# Altium schematic sheet sdhc_memory_card.SchDoc
size A
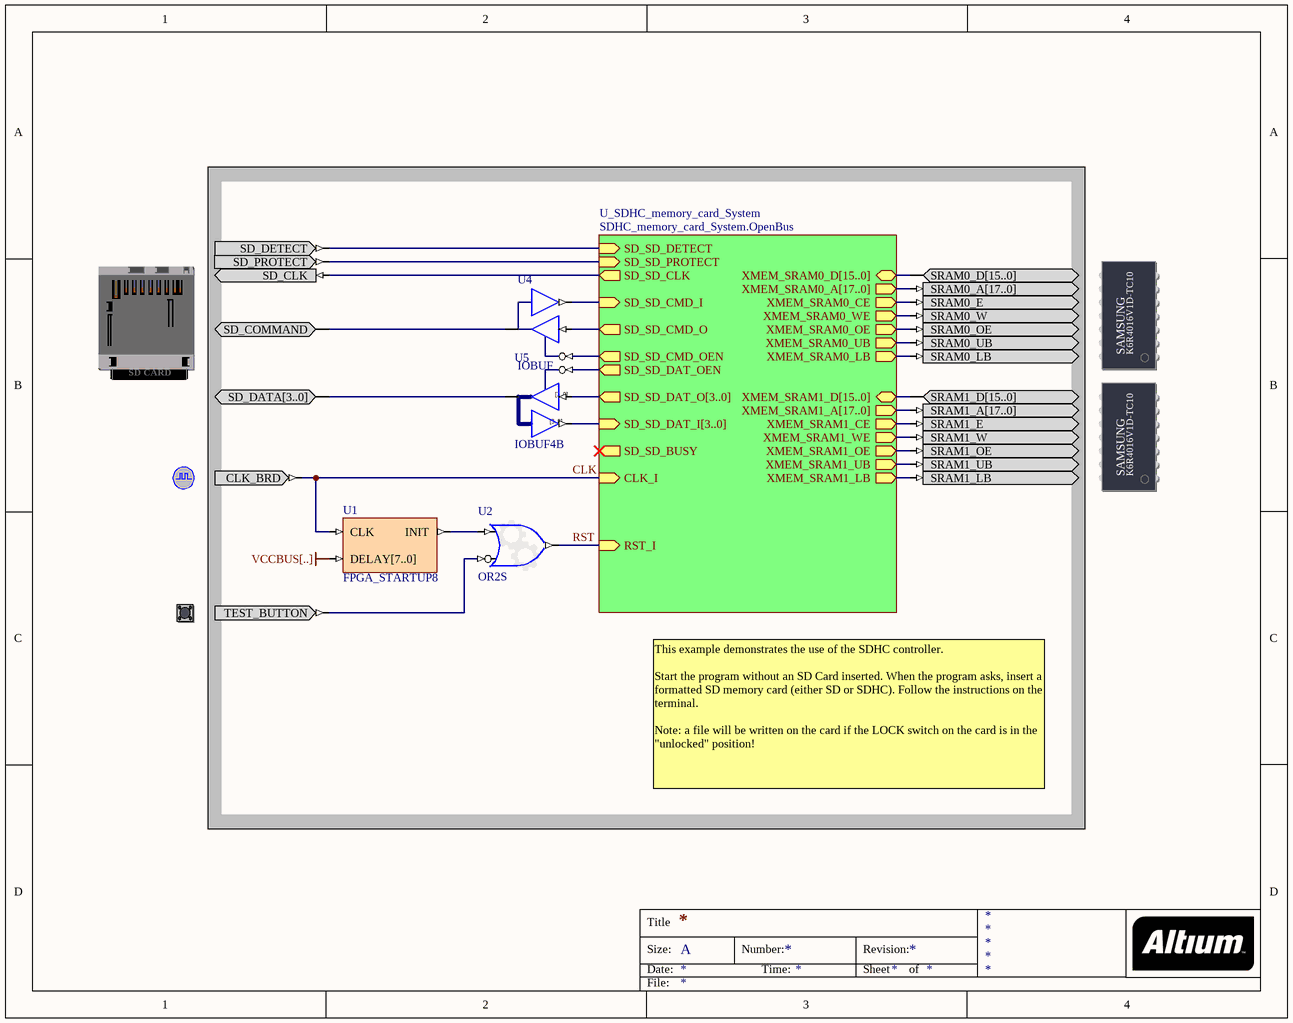
[diagram p0: sdhc_memory_card.SchDoc]

## Parts
(Parts that share a designator on the sheet are numbered #1, #2 ... from top to bottom, then left to right.)
?#1  SDHC  (value not drawn)
?#2  SRAM_DAUGHTER0  (value not drawn)
?#3  SRAM_DAUGHTER1  (value not drawn)
?#4  CLOCK_BOARD  (value not drawn)
?#5  TEST_BUTTON  (value not drawn)
U1  FPGA_STARTUP8
U2  OR2S
U4  IOBUF
U5  IOBUF4B

## Sub-sheets
U_SDHC_memory_card_System = SDHC_memory_card_System.OpenBus: XMEM_SRAM0_D[15..0] (bidir), XMEM_SRAM0_A[17..0] (out), XMEM_SRAM0_CE (out), XMEM_SRAM0_WE (out), XMEM_SRAM0_OE (out), XMEM_SRAM0_UB (out), XMEM_SRAM0_LB (out), XMEM_SRAM1_D[15..0] (bidir), XMEM_SRAM1_A[17..0] (out), XMEM_SRAM1_CE (out), XMEM_SRAM1_WE (out), XMEM_SRAM1_OE (out), XMEM_SRAM1_UB (out), XMEM_SRAM1_LB (out), SD_SD_DETECT (in), SD_SD_PROTECT (in), SD_SD_CLK (out), RST_I (in), CLK_I (in), SD_SD_BUSY (out), SD_SD_CMD_OEN (out), SD_SD_CMD_O (out), SD_SD_CMD_I (in), SD_SD_DAT_OEN (out), SD_SD_DAT_O[3..0] (out), SD_SD_DAT_I[3..0] (in)

## Nets
VCCBUS[..]: U1.DELAY[7..0]
CLK: ?#4.CLK_BRD U1.CLK ; sheet U_SDHC_memory_card_System/CLK_I
RST: U2.O ; sheet U_SDHC_memory_card_System/RST_I
Net?#1_SD_CLK: ?#1.SD_CLK ; sheet U_SDHC_memory_card_System/SD_SD_CLK
Net?#1_SD_COMMAND: ?#1.SD_COMMAND U4.IO
Net?#1_SD_DATA[3..0]: ?#1.SD_DATA[3..0] U5.IO[3..0]
Net?#1_SD_DETECT: ?#1.SD_DETECT ; sheet U_SDHC_memory_card_System/SD_SD_DETECT
Net?#1_SD_PROTECT: ?#1.SD_PROTECT ; sheet U_SDHC_memory_card_System/SD_SD_PROTECT
Net?#2_SRAM0_A[17..0]: ?#2.SRAM0_A[17..0] ; sheet U_SDHC_memory_card_System/XMEM_SRAM0_A[17..0]
Net?#2_SRAM0_D[15..0]: ?#2.SRAM0_D[15..0] ; sheet U_SDHC_memory_card_System/XMEM_SRAM0_D[15..0]
Net?#2_SRAM0_E: ?#2.SRAM0_E ; sheet U_SDHC_memory_card_System/XMEM_SRAM0_CE
Net?#2_SRAM0_LB: ?#2.SRAM0_LB ; sheet U_SDHC_memory_card_System/XMEM_SRAM0_LB
Net?#2_SRAM0_OE: ?#2.SRAM0_OE ; sheet U_SDHC_memory_card_System/XMEM_SRAM0_OE
Net?#2_SRAM0_UB: ?#2.SRAM0_UB ; sheet U_SDHC_memory_card_System/XMEM_SRAM0_UB
Net?#2_SRAM0_W: ?#2.SRAM0_W ; sheet U_SDHC_memory_card_System/XMEM_SRAM0_WE
Net?#3_SRAM1_A[17..0]: ?#3.SRAM1_A[17..0] ; sheet U_SDHC_memory_card_System/XMEM_SRAM1_A[17..0]
Net?#3_SRAM1_D[15..0]: ?#3.SRAM1_D[15..0] ; sheet U_SDHC_memory_card_System/XMEM_SRAM1_D[15..0]
Net?#3_SRAM1_E: ?#3.SRAM1_E ; sheet U_SDHC_memory_card_System/XMEM_SRAM1_CE
Net?#3_SRAM1_LB: ?#3.SRAM1_LB ; sheet U_SDHC_memory_card_System/XMEM_SRAM1_LB
Net?#3_SRAM1_OE: ?#3.SRAM1_OE ; sheet U_SDHC_memory_card_System/XMEM_SRAM1_OE
Net?#3_SRAM1_UB: ?#3.SRAM1_UB ; sheet U_SDHC_memory_card_System/XMEM_SRAM1_UB
Net?#3_SRAM1_W: ?#3.SRAM1_W ; sheet U_SDHC_memory_card_System/XMEM_SRAM1_WE
Net?#5_TEST_BUTTON: ?#5.TEST_BUTTON U2.I1
NetU1_INIT: U1.INIT U2.I0
NetU4_I: U4.I ; sheet U_SDHC_memory_card_System/SD_SD_CMD_O
NetU4_O: U4.O ; sheet U_SDHC_memory_card_System/SD_SD_CMD_I
NetU4_T: U4.T ; sheet U_SDHC_memory_card_System/SD_SD_CMD_OEN
NetU5_I[3..0]: U5.I[3..0] ; sheet U_SDHC_memory_card_System/SD_SD_DAT_O[3..0]
NetU5_O[3..0]: U5.O[3..0] ; sheet U_SDHC_memory_card_System/SD_SD_DAT_I[3..0]
NetU5_T: U5.T ; sheet U_SDHC_memory_card_System/SD_SD_DAT_OEN

## Notes on the sheet
- This example demonstrates the use of the SDHC controller.
  Start the program without an SD Card inserted. When the program asks, insert a formatted SD memory card (either SD or SDHC). Follow the instructions on the terminal.
  Note: a file will be written on the card if the LOCK switch on the card is in the "unlocked" position!
- Title
- Size:
- Date:
- A
- Number:
- Time:
- Revision:
- Sheet
- of
- File:
- (in symbol IOBUF4B) [3..0]
- (in symbol SDHC) SD CARD
- (in symbol SRAM_DAUGHTER0) SAMSUNG; K6R4016V1D-TC10
- (in symbol SRAM_DAUGHTER1) SAMSUNG; K6R4016V1D-TC10

## Library data of the parts
?#1 = SDHC: High Capacity Secure Digital Socket; PortComponent: True; Published: 30-Nov-2009; Publisher: Altium Limited; UseInDSF: True; HelpURL: http://wiki.altium.com/display/ADOH/NanoBoard+3000+-+SD+Card+Reader+%28Host+FPGA%29
?#2 = SRAM_DAUGHTER0: Free Static RAM - Daughterboard; PortComponent: True; Published: 14-May-2007; Publisher: Altium Limited; HelpURL: https://wiki.altium.com/display/ADOH/Daughter+Board+Independent+SRAM
?#3 = SRAM_DAUGHTER1: Free Static RAM - Daughterboard; PortComponent: True; Published: 14-May-2007; Publisher: Altium Limited; HelpURL: https://wiki.altium.com/display/ADOH/Daughter+Board+Independent+SRAM
?#4 = CLOCK_BOARD: Global System Clock Supply; PortComponent: True; Published: 19-Nov-2003; Publisher: Altium Limited; HelpURL: https://wiki.altium.com/display/ADOH/NB2DSK01+-+System+Clocks; UseInDSF: True
?#5 = TEST_BUTTON: Test / Reset Button; PortComponent: True; Published: 19-Nov-2003; Publisher: Altium Limited; HelpURL: https://wiki.altium.com/display/ADOH/NB2DSK01+-+Daughter+Board+Test-Reset+Button
U1 = FPGA_STARTUP8: FPGA Startup With 8 Bit Delay; Published: 9-Dec-2004; Publisher: Altium Limited; HelpURL: CR0119 FPGA_STARTUPx Powerup Delay Unit.pdf; LastRevisionNo: 1.00.00; ComponentLink1Description: Core &Resource Usage; ComponentLink1URL: CR0139 FPGA Peripheral Resource Usage.pdf#page=11
U2 = GATE: Configurable Generic Gate; ConfiguratorName: GENERIC_GATE; ConfigurationParameters: {}Version[1.0]{}GateKind[OR]{}BusInput[False]{}GateInputType[Bit]{}GateOutputOption[Normal]{}BusWidth[8]{}RegisterOutputs[False]{}NegativeClockEdge[False]{}InputCount[2]{}InputInvert0[False]{}InputInvert1[True]{}; LastRevisionNo: 1.00.00; Published: 3-Sep-2008; Publisher: Altium Limited
U4 = IOBUF: Input/Output Buffer; Enable: Low; Control: Common Control T; ArchiveName: GENERIC; VHDLIB_SIM: GENERIC_LIB; Published: 29-Jan-2004; Publisher: Altium Limited; XilinxEquivalent: IOBUF; LastRevisionNo: 1.00.00; HelpURL: CR0118 FPGA Generic Library Guide.pdf#page=293; ComponentLink1URL: CR0125 FPGA Buffer Resource Usage.pdf#page=78; ComponentLink1Description: Core &Resource Usage; FunctionalClass: Buffer; SubClass: IOBUF
U5 = IOBUF4B: 4-Bit Input/Output Buffer, Bus Version; SubClass: IOBUF; Enable: Low; Control: Common Control T; PortSize: 4; ArchiveName: GENERIC; VHDLIB_SIM: GENERIC_LIB; Published: 29-Jan-2004; Publisher: Altium Limited; LastRevisionNo: 1.00.00; HelpURL: CR0118 FPGA Generic Library Guide.pdf#page=293; ComponentLink1URL: CR0125 FPGA Buffer Resource Usage.pdf#page=82; ComponentLink1Description: Core &Resource Usage; FunctionalClass: Buffer; PortStyle: Bus Version